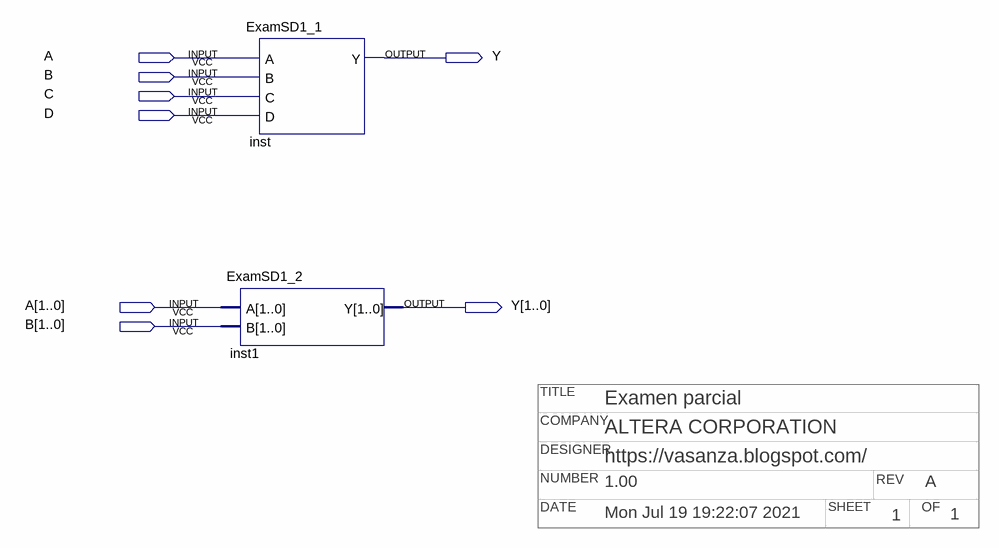
[diagram p0: schematic sheet]
// Quartus schematic ExamenParcial.bdf as structural Verilog: 2 symbols, 8 pins
// Title block: COMPANY: ALTERA CORPORATION; DATE: Mon Jul 19 19:22:07 2021; DESIGNER: https://vasanza.blogspot.com/; NUMBER: 1.00; OF: 1; REV: A; SHEET: 1; TITLE: Examen parcial
module ExamenParcial (
  input  A_1bit,
  input  B_1bit,
  input  C,
  input  D,
  input  [1:0] A,
  input  [1:0] B,
  output Y_1bit,
  output [1:0] Y
);

  ExamSD1_2 inst1 (.A(A), .B(B), .Y(Y));
  ExamSD1_1 inst (.A(A_1bit), .B(B_1bit), .C(C), .D(D), .Y(Y_1bit));
endmodule
